# EAGLE design Adapter_SPI (EAGLE 9.6.2)
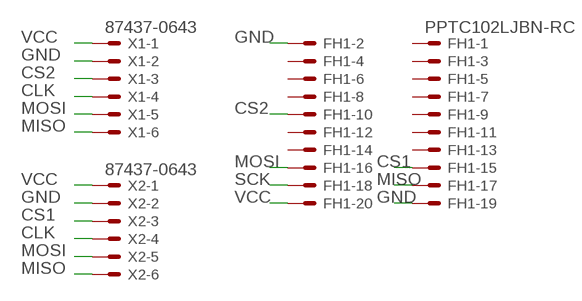
[diagram p0: schematic, sheet 1]

## Parts
FH1  PPTC102LJBN-RC  [S5524-ND]
X1  87437-0643  [87437-06]
X2  87437-0643  [87437-06]

## Nets
CLK: X1.4 X2.4
CS1: FH1.P$15 X2.3
CS2: FH1.P$10 X1.3
GND: FH1.P$2 FH1.P$19 X1.2 X2.2
MISO: FH1.P$17 X1.6 X2.6
MOSI: FH1.P$16 X1.5 X2.5
SCK: FH1.P$18
VCC: FH1.P$20 X1.1 X2.1
Unconnected: FH1.P$1 FH1.P$3 FH1.P$4 FH1.P$5 FH1.P$6 FH1.P$7 FH1.P$8 FH1.P$9 FH1.P$11 FH1.P$12 FH1.P$13 FH1.P$14

## Library data of the parts
FH1 = msrm:PPTC102LJBN-RC; DIGIKEY: S5524-ND; PINS: 20; PITCH: 2,54"
X1 X2 = msrm:8743?-06*3: Wire-to-Board 1.50mm (.059") Pitch Header - SMT, Shrouded Source: http://www.molex.com/product/micro/87437.html; DIGIKEY: WM7665CT-ND; MF: MOLEX

## Board
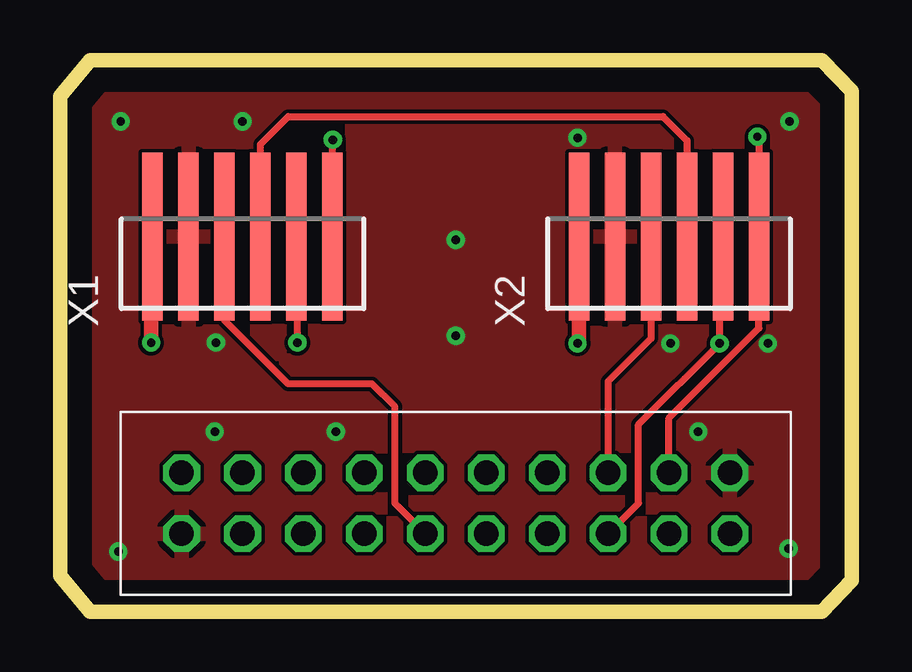
[diagram p1: board, top side]
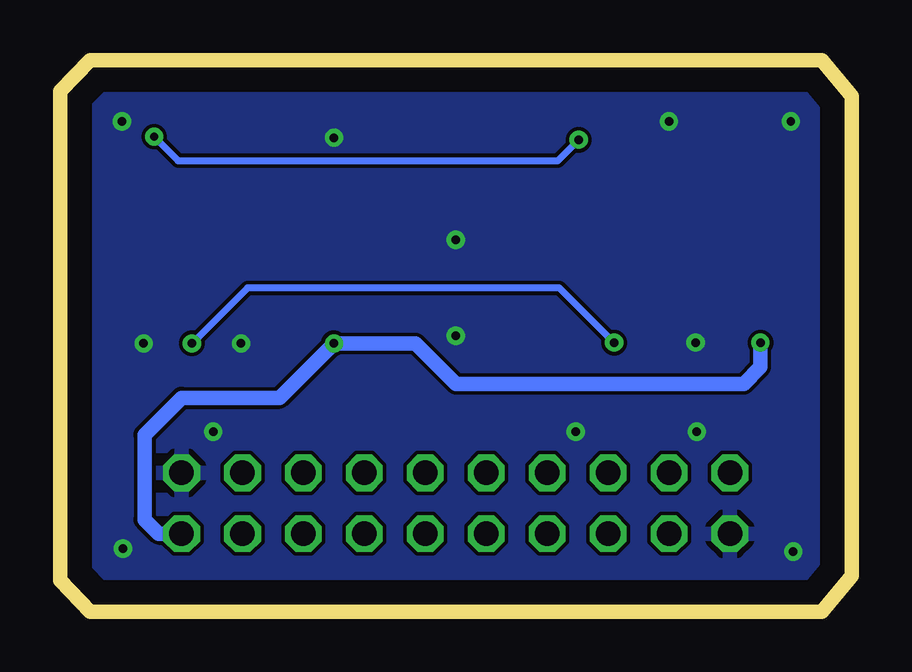
[diagram p2: board, bottom side, seen from below]

Size 33 x 23 mm. Coordinates in mm from the lower left corner, seen from the top.
Outline: 0,1.5 1.25,0 31.75,0 33,1.3 33,21.7 31.75,23 1.25,23 0,21.5 0,1.5
Copper layers (1*16): Top 0.035mm / dielectric 1.5mm / Bottom 0.035mm
Design rules "default": minimum track width 6mil, minimum drill 0.35mm, track to track 6mil, track to pad 6mil, pad to pad 6mil, via to via 6mil, smd to smd 6mil, copper to edge 40mil, drill to drill 6mil, minimum pad ring 10mil, minimum via ring 8mil, stop-mask expansion 4mil, vias tented up to drill 0mil, thermal gap 10mil

### Footprints (pad centres in the part's own frame; a part is rotated, then mirrored left to right if it is on the bottom)
S5524-ND = drill 1.02 octagon: P$1 -11.43,1.27; P$2 -11.43,-1.27; P$3 -8.89,1.27; P$4 -8.89,-1.27; P$5 -6.35,1.27; P$6 -6.35,-1.27; P$7 -3.81,1.27; P$8 -3.81,-1.27; P$9 -1.27,1.27; P$10 -1.27,-1.27; P$11 1.27,1.27; P$12 1.27,-1.27; P$13 3.81,1.27; P$14 3.81,-1.27; P$15 6.35,1.27; P$16 6.35,-1.27; P$17 8.89,1.27; P$18 8.89,-1.27; P$19 11.43,1.27; P$20 11.43,-1.27
87437-06 = smd 7 x 0.85: 1 0,3.75; 2 0,2.25; 3 0,0.75; 4 0,-0.75; 5 0,-2.25; 6 0,-3.75

### Placement (x,y rotation side)
FH1  16.5,4.51 0 top
X1  7.61,15.63 90 top
X2  25.39,15.63 90 top

### Tracks (layer width: path | path; a pad name or v marks a point on that pad's centre or on a via)
CLK
  Top 0.3: X1.4 8.36,19.49 9.52,20.64 25.14,20.64 26.14,19.64 X2.4
CS1
  Top 0.3: X2.3 24.64,11.38 22.85,9.6 FH1.P$15
CS2
  Top 0.3: FH1.P$10 13.96,4.51 13.96,8.55 13.01,9.5 9.5,9.5 6.86,12.14 X1.3
GND  (via drill 0.35)
  other vias: 2.53,20.44 16.5,15.5 16.5,11.5 7.61,20.44 29.52,11.18 2.43,2.5 30.37,2.63 30.42,20.44 25.45,11.18 6.5,11.21 6.45,7.5 26.61,7.5 11.5,7.5 21.58,19.76
  pour Top: 1.26,22.93 -0.01,21.66 -0.01,1.34 1.26,0.07 31.74,0.07 33.01,1.34 33.01,21.66 31.74,22.93
  pour Bottom: 1.51,22.93 -0.01,21.41 -0.01,1.34 1.26,0.07 31.74,0.07 33.01,1.34 33.01,21.41 31.49,22.93
MISO  (via drill 0.35)
  Top 0.3: X1.6 v11.36,19.66 v11.37,19.68 | v29.07,19.8 29.14,19.73 X2.6 29.14,11.82 25.39,8.07 FH1.P$17
  Bottom 0.3: v29.07,19.8 28.07,18.8 12.25,18.8 v11.37,19.68
MOSI  (via drill 0.35)
  Top 0.3: X2.5 27.5,15.49 v27.5,11.18 24.12,7.8 24.12,4.51 FH1.P$16 | v9.9,11.21 9.9,15.59 X1.5
  Bottom 0.3: v9.9,11.21 12.18,13.5 25.18,13.5 v27.5,11.18
VCC  (via drill 0.35)
  Top 0.6: v3.8,11.21 3.8,15.57 X1.1
  Top 0.61: X2.1 21.64,11.24 v21.58,11.18
  Bottom 0.6: v21.58,11.18 18.18,11.18 16.5,9.5 4.5,9.5 3.8,10.2 v3.8,11.21
  Bottom 0.61: v21.58,11.18 23.85,8.91 27.93,8.91 29.47,7.37 29.47,3.83 28.88,3.24 FH1.P$20